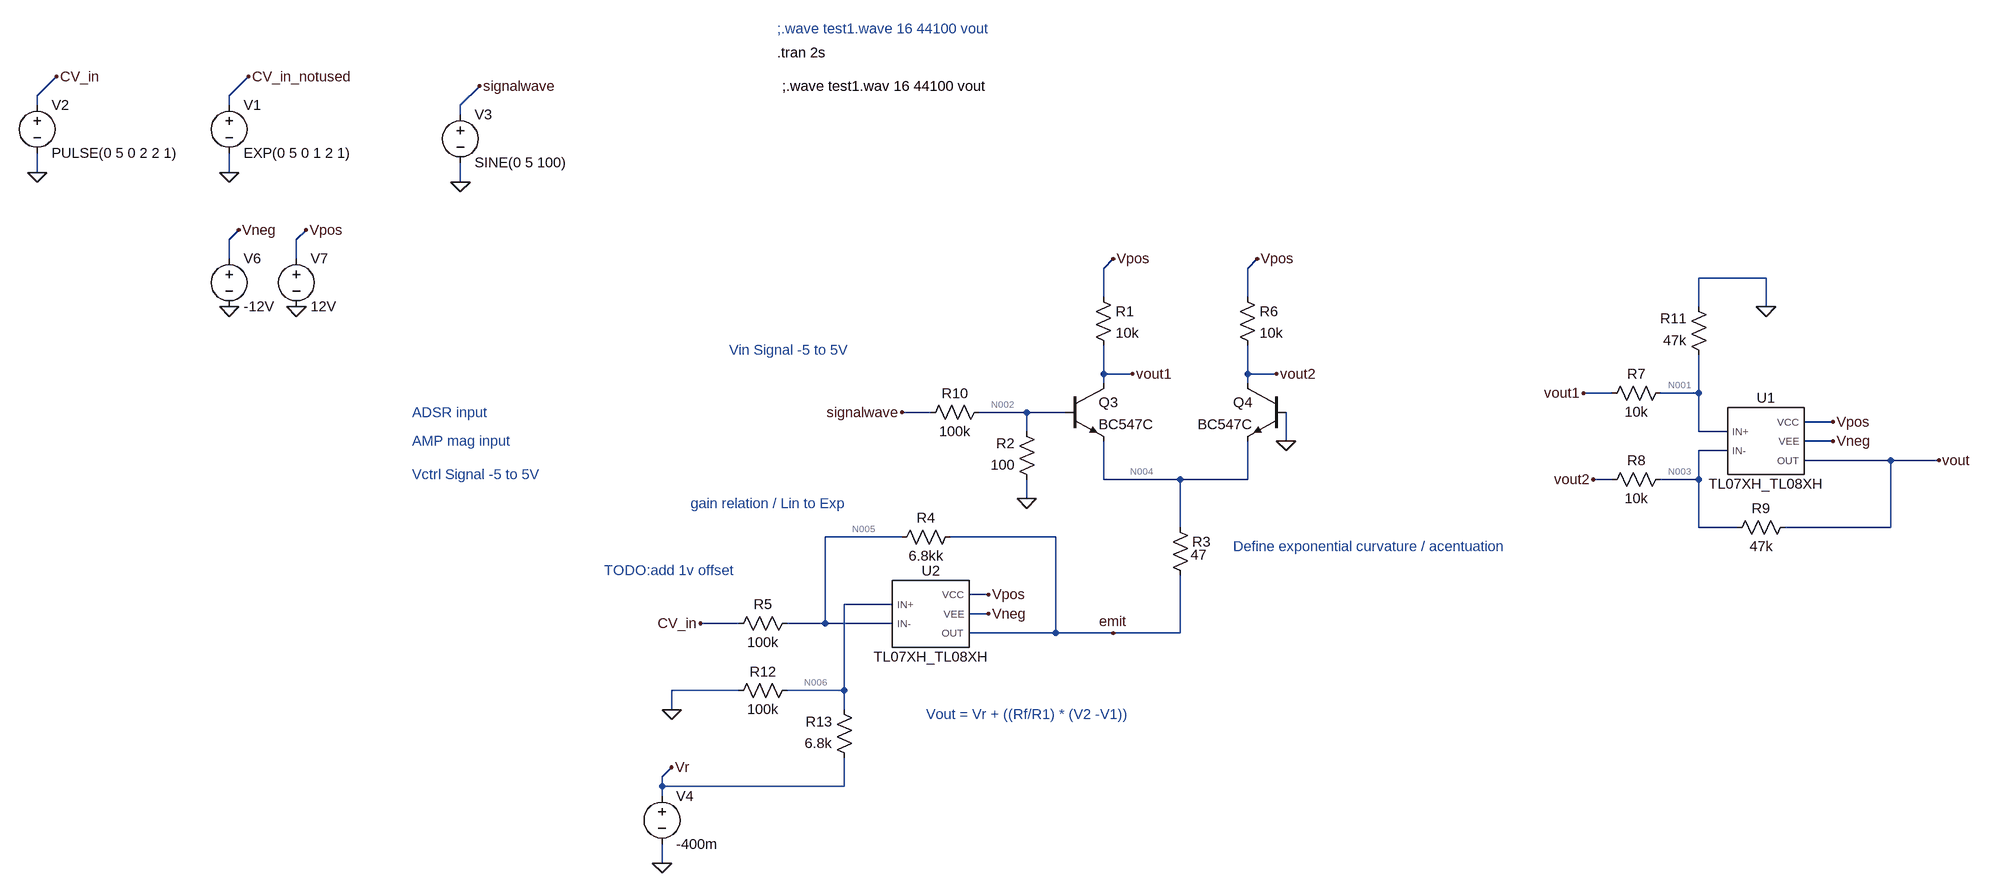
[diagram p0: schematic main_VCA_exp.asc]
main_VCA_exp.asc, the LTspice schematic file:
Version 4
SHEET 1 3072 1764
WIRE -1760 -352 -1728 -384
WIRE -1440 -352 -1408 -384
WIRE -1760 -336 -1760 -352
WIRE -1440 -336 -1440 -352
WIRE -1008 -336 -976 -368
WIRE -1008 -320 -1008 -336
WIRE -1760 -224 -1760 -256
WIRE -1440 -224 -1440 -256
WIRE -1008 -208 -1008 -240
WIRE -1440 -112 -1424 -128
WIRE -1328 -112 -1312 -128
WIRE -1440 -80 -1440 -112
WIRE -1328 -80 -1328 -112
WIRE 64 -64 80 -80
WIRE 304 -64 320 -80
WIRE 1168 -48 1056 -48
WIRE 64 -16 64 -64
WIRE 304 -16 304 -64
WIRE 1056 0 1056 -48
WIRE 1168 0 1168 -48
WIRE 64 112 64 64
WIRE 112 112 64 112
WIRE 304 112 304 64
WIRE 352 112 304 112
WIRE 64 128 64 112
WIRE 304 128 304 112
WIRE 912 144 864 144
WIRE 1056 144 1056 80
WIRE 1056 144 992 144
WIRE -224 176 -272 176
WIRE -64 176 -144 176
WIRE 0 176 -64 176
WIRE 1280 192 1232 192
WIRE -64 208 -64 176
WIRE 1056 208 1056 144
WIRE 1104 208 1056 208
WIRE 368 224 368 176
WIRE 1280 224 1232 224
WIRE 1104 240 1056 240
WIRE 1376 256 1232 256
WIRE 1456 256 1376 256
WIRE 64 288 64 224
WIRE 192 288 64 288
WIRE 304 288 304 224
WIRE 304 288 192 288
WIRE 912 288 880 288
WIRE 1056 288 1056 240
WIRE 1056 288 992 288
WIRE -64 320 -64 288
WIRE 192 368 192 288
WIRE 1056 368 1056 288
WIRE 1120 368 1056 368
WIRE 1376 368 1376 256
WIRE 1376 368 1200 368
WIRE -272 384 -400 384
WIRE -16 384 -192 384
WIRE -128 480 -160 480
WIRE -288 496 -368 496
WIRE -128 512 -160 512
WIRE -544 528 -608 528
WIRE -400 528 -400 384
WIRE -400 528 -464 528
WIRE -288 528 -400 528
WIRE -16 544 -16 384
WIRE -16 544 -160 544
WIRE 80 544 -16 544
WIRE 192 544 192 448
WIRE 192 544 80 544
WIRE -544 640 -656 640
WIRE -368 640 -368 496
WIRE -368 640 -464 640
WIRE -656 672 -656 640
WIRE -368 672 -368 640
WIRE -672 784 -656 768
WIRE -672 800 -672 784
WIRE -368 800 -368 752
WIRE -368 800 -672 800
WIRE -672 816 -672 800
WIRE -672 928 -672 896
FLAG 368 224 0
FLAG 80 -80 Vpos
FLAG -128 512 Vneg
FLAG -128 480 Vpos
FLAG -1440 0 0
FLAG -1328 0 0
FLAG -1424 -128 Vneg
FLAG -1312 -128 Vpos
FLAG -1440 -224 0
FLAG -1408 -384 CV_in_notused
FLAG -64 320 0
FLAG 320 -80 Vpos
FLAG -272 176 signalwave
FLAG -608 528 CV_in
FLAG 112 112 vout1
FLAG 352 112 vout2
FLAG 80 544 emit
FLAG -1008 -208 0
FLAG -976 -368 signalwave
FLAG 1168 0 0
FLAG 864 144 vout1
FLAG 880 288 vout2
FLAG 1280 192 Vpos
FLAG 1280 224 Vneg
FLAG 1456 256 vout
FLAG -1760 -224 0
FLAG -1728 -384 CV_in
FLAG -656 672 0
FLAG -672 928 0
FLAG -656 768 Vr
SYMBOL res 176 352 R0
WINDOW 3 33 62 Left 2
SYMATTR Value 47
SYMATTR InstName R3
SYMBOL npn 0 128 R0
SYMATTR InstName Q3
SYMATTR Value BC547C
SYMBOL npn 368 128 M0
SYMATTR InstName Q4
SYMATTR Value BC547C
SYMBOL res 48 -32 R0
SYMATTR InstName R1
SYMATTR Value 10k
SYMBOL voltage -1440 -96 R0
WINDOW 123 0 0 Left 0
WINDOW 39 0 0 Left 0
SYMATTR InstName V6
SYMATTR Value -12V
SYMBOL voltage -1328 -96 R0
WINDOW 123 0 0 Left 0
WINDOW 39 0 0 Left 0
SYMATTR InstName V7
SYMATTR Value 12V
SYMBOL res -128 160 R90
WINDOW 0 0 56 VBottom 2
WINDOW 3 32 56 VTop 2
SYMATTR InstName R10
SYMATTR Value 100k
SYMBOL voltage -1440 -352 R0
WINDOW 123 0 0 Left 0
WINDOW 39 0 0 Left 0
SYMATTR InstName V1
SYMATTR Value EXP(0 5 0 1 2 1)
SYMBOL TL07XH_TL08XH -224 512 R0
SYMATTR InstName U2
SYMBOL res -176 368 R90
WINDOW 0 0 56 VBottom 2
WINDOW 3 32 56 VTop 2
SYMATTR InstName R4
SYMATTR Value 6.8kk
SYMBOL res -448 512 R90
WINDOW 0 0 56 VBottom 2
WINDOW 3 32 56 VTop 2
SYMATTR InstName R5
SYMATTR Value 100k
SYMBOL res -48 304 R180
WINDOW 0 36 76 Left 2
WINDOW 3 36 40 Left 2
SYMATTR InstName R2
SYMATTR Value 100
SYMBOL res 288 -32 R0
SYMATTR InstName R6
SYMATTR Value 10k
SYMBOL voltage -1008 -336 R0
WINDOW 123 0 0 Left 0
WINDOW 39 0 0 Left 0
SYMATTR InstName V3
SYMATTR Value SINE(0 5 100)
SYMBOL TL07XH_TL08XH 1168 224 R0
SYMATTR InstName U1
SYMBOL res 1008 128 R90
WINDOW 0 0 56 VBottom 2
WINDOW 3 32 56 VTop 2
SYMATTR InstName R7
SYMATTR Value 10k
SYMBOL res 1008 272 R90
WINDOW 0 0 56 VBottom 2
WINDOW 3 32 56 VTop 2
SYMATTR InstName R8
SYMATTR Value 10k
SYMBOL res 1216 352 R90
WINDOW 0 0 56 VBottom 2
WINDOW 3 32 56 VTop 2
SYMATTR InstName R9
SYMATTR Value 47k
SYMBOL res 1072 96 R180
WINDOW 0 36 76 Left 2
WINDOW 3 36 40 Left 2
SYMATTR InstName R11
SYMATTR Value 47k
SYMBOL voltage -1760 -352 R0
WINDOW 123 0 0 Left 0
WINDOW 39 0 0 Left 0
SYMATTR InstName V2
SYMATTR Value PULSE(0 5 0 2 2 1)
SYMBOL res -448 624 R90
WINDOW 0 0 56 VBottom 2
WINDOW 3 32 56 VTop 2
SYMATTR InstName R12
SYMATTR Value 100k
SYMBOL res -352 768 R180
WINDOW 0 36 76 Left 2
WINDOW 3 36 40 Left 2
SYMATTR InstName R13
SYMATTR Value 6.8k
SYMBOL voltage -672 800 R0
WINDOW 123 0 0 Left 0
WINDOW 39 0 0 Left 0
SYMATTR InstName V4
SYMATTR Value -400m
TEXT -480 -424 Left 2 !.tran 2s
TEXT -560 72 Left 2 ;Vin Signal -5 to 5V
TEXT -1088 224 Left 2 ;AMP mag input
TEXT -1088 280 Left 2 ;Vctrl Signal -5 to 5V
TEXT -1088 176 Left 2 ;ADSR input
TEXT -480 -464 Left 2 ;;.wave test1.wave 16 44100 vout
TEXT -472 -368 Left 2 !;.wave test1.wav 16 44100 vout
TEXT 280 400 Left 2 ;Define exponential curvature / acentuation
TEXT -624 328 Left 2 ;gain relation / Lin to Exp
TEXT -768 440 Left 2 ;TODO:add 1v offset
TEXT -232 680 Left 2 ;Vout = Vr + ((Rf/R1) * (V2 -V1))

The netlist it stands for:
* main_VCA_exp.asc
R3 N004 emit 47
Q3 vout1 N002 N004 0 BC547C
Q4 vout2 0 N004 0 BC547C
R1 Vpos vout1 10k
V6 Vneg 0 -12V
V7 Vpos 0 12V
R10 N002 signalwave 100k
V1 CV_in_notused 0 EXP(0 5 0 1 2 1)
XU2 N006 N005 Vpos Vneg emit TL07XH_TL08XH  ; pins IN+ IN- VCC VEE OUT
R4 emit N005 6.8kk
R5 N005 CV_in 100k
R2 0 N002 100
R6 Vpos vout2 10k
V3 signalwave 0 SINE(0 5 100)
XU1 N001 N003 Vpos Vneg vout TL07XH_TL08XH  ; pins IN+ IN- VCC VEE OUT
R7 N001 vout1 10k
R8 N003 vout2 10k
R9 vout N003 47k
R11 N001 0 47k
V2 CV_in 0 PULSE(0 5 0 2 2 1)
R12 N006 0 100k
R13 Vr N006 6.8k
V4 Vr 0 -400m
.model NPN NPN
.model PNP PNP
.lib standard.bjt
.tran 2s
* Vin Signal -5 to 5V
* AMP mag input
* Vctrl Signal -5 to 5V
* ADSR input
* ;.wave test1.wave 16 44100 vout
;.wave test1.wav 16 44100 vout
* Define exponential curvature / acentuation
* gain relation / Lin to Exp
* TODO:add 1v offset
* Vout = Vr + ((Rf/R1) * (V2 -V1))
.lib C:\HOME_projects\SYNTH_GOOM\2LineartoExponential\tl07xh_tl08xh.lib
.backanno
.end

* Results of the author's LTspice run, read from the files saved beside the schematic
* Operating Point, zero values left out:
*   V(n004) = -404.7 mV
*   V(emit) = -404.7 mV
*   V(vout1) = 10.21 V
*   V(n002) = -58.72 nV
*   V(vout2) = 10.2 V
*   V(vpos) = 12 V
*   V(vneg) = -12 V
*   V(n005) = -379 mV
*   V(n006) = -374.5 mV
*   V(vout) = -14.76 mV
*   V(n003) = 8.411 V
*   V(n001) = 8.416 V
*   V(vr) = -400 mV
*   Ic(Q4) = 298.3 nA
*   Ib(Q4) = 587.8 pA
*   Ie(Q4) = -298.9 nA
*   Ic(Q3) = 298.3 nA
*   Ib(Q3) = 587.8 pA
*   Ie(Q3) = -298.9 nA
*   I(R13) = -3.745 µA
*   I(R12) = -3.745 µA
*   I(R11) = 179.1 µA
*   I(R9) = -179.3 µA
*   I(R8) = -179.3 µA
*   I(R7) = -179.1 µA
*   I(R6) = 179.6 µA
*   I(R2) = 587.2 pA
*   I(R5) = -3.79 µA
*   I(R4) = -3.79 µA
*   I(R1) = 179.4 µA
*   I(R3) = 597.8 nA
*   I(V4) = 3.745 µA
*   I(V2) = -3.79 µA
*   I(V7) = -2.234 mA
*   I(V6) = 2.059 mA
*   Ix(u2:IN-) = -1.399 pA
*   Ix(u2:VCC) = 937.5 µA
*   Ix(u2:VEE) = -941.9 µA
*   Ix(u2:OUT) = 4.387 µA
*   Ix(u1:IN+) = 43.7 pA
*   Ix(u1:IN-) = 42.63 pA
*   Ix(u1:VCC) = 937.5 µA
*   Ix(u1:VEE) = -1.117 mA
*   Ix(u1:OUT) = 179.3 µA
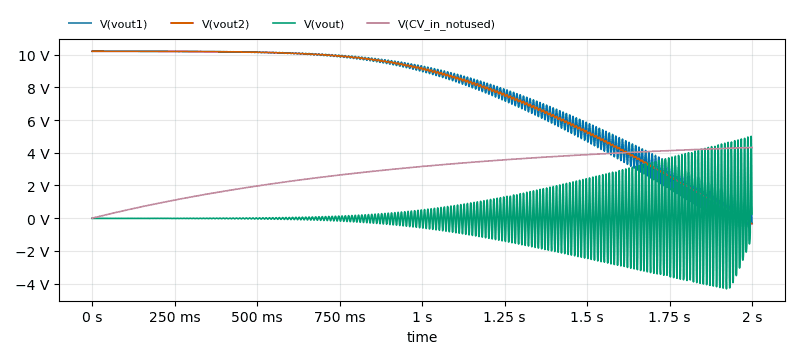
[diagram p1: Transient Analysis of main_VCA_exp.asc, plotted from the saved traces]
* Transient Analysis, 1 run:
*   V(vout1): min -558.3 mV, max 10.21 V, average 7.503 V, rms 8.161 V, last -293.5 mV
*   V(vout2): min -352.6 mV, max 10.2 V, average 7.493 V, rms 8.152 V, last -352.6 mV
*   V(vout): min -4.322 V, max 5.005 V, average 24.99 mV, rms 1.39 V, last 252.9 mV
*   V(CV_in_notused): min 0 V, max 4.323 V, average 2.838 V, rms 3.085 V, last 4.323 V